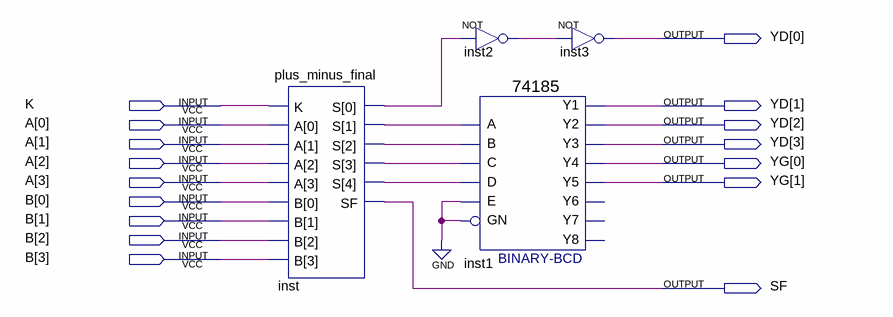
[diagram p0: schematic sheet]
// Quartus schematic plus_minus_BCD.bdf as structural Verilog: 4 symbols, 16 pins
module plus_minus_BCD (
  input  K,
  input  [3:0] A,
  input  [3:0] B,
  output [3:0] YD,
  output [1:0] YG,
  output SF
);

  wire inst2_out, inst_s, inst_s_2, inst_s_3, inst_s_4, inst_s_5;

  plus_minus_final inst (.K(K), .A(A), .B(B), .S({inst_s_4, inst_s_5, inst_s_3, inst_s_2, inst_s}), .SF(SF));
  not inst2 (inst2_out, inst_s);
  \74185  inst1 (
    .A(inst_s_2), .B(inst_s_3), .D(inst_s_4), .C(inst_s_5), .E(1'b0), .GN(1'b0), .Y1(YD[1]), .Y3(YD[3]),
    .Y2(YD[2]), .Y5(YG[1]), .Y4(YG[0]));  // open: Y6, Y8, Y7
  not inst3 (YD[0], inst2_out);
endmodule
